# Altium schematic sheet touch.SchDoc
size A4; SheetNumber: 2; SheetTotal: 3
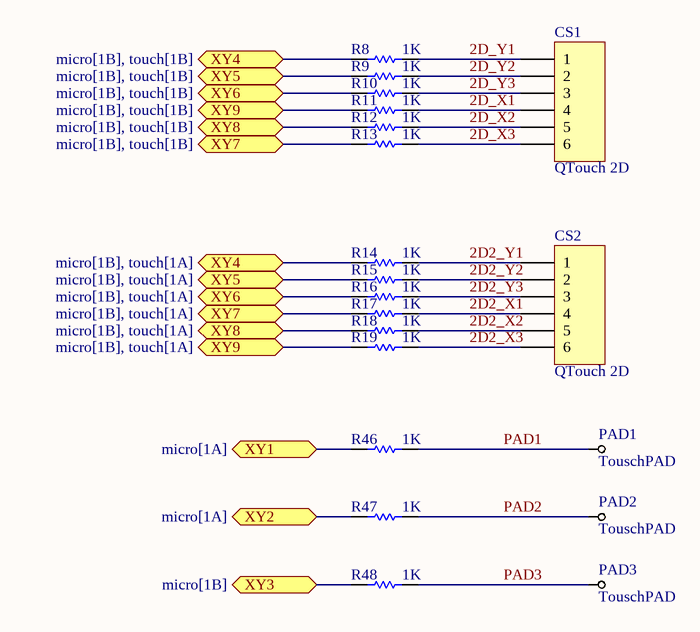
[diagram p0: touch.SchDoc]

## Parts
CS1  QTouch 2D  [wheel]
CS2  QTouch 2D  [2D_touch _wheel]
PAD1  TouschPAD  [touchpad7]  (no BOM)
PAD2  TouschPAD  [touchpad7]  (no BOM)
PAD3  TouschPAD  [touchpad7]  (no BOM)
R8  1K  [RES 0805 (2012X06L)]
R9  1K  [RES 0805 (2012X06L)]
R10  1K  [RES 0805 (2012X06L)]
R11  1K  [RES 0805 (2012X06L)]
R12  1K  [RES 0805 (2012X06L)]
R13  1K  [RES 0805 (2012X06L)]
R14  1K  [RES 0805 (2012X06L)]
R15  1K  [RES 0805 (2012X06L)]
R16  1K  [RES 0805 (2012X06L)]
R17  1K  [RES 0805 (2012X06L)]
R18  1K  [RES 0805 (2012X06L)]
R19  1K  [RES 0805 (2012X06L)]
R46  1K  [RES 0805 (2012X06L)]
R47  1K  [RES 0805 (2012X06L)]
R48  1K  [RES 0805 (2012X06L)]

## Ports
XY1 (bidir, see micro[1A]), XY2 (bidir, see micro[1A]), XY3 (bidir, see micro[1B]), XY4 (bidir, see micro[1B], touch[1A]), XY4 (bidir, see micro[1B], touch[1B]), XY5 (bidir, see micro[1B], touch[1A]), XY5 (bidir, see micro[1B], touch[1B]), XY6 (bidir, see micro[1B], touch[1A]), XY6 (bidir, see micro[1B], touch[1B]), XY7 (bidir, see micro[1B], touch[1A]), XY7 (bidir, see micro[1B], touch[1B]), XY8 (bidir, see micro[1B], touch[1A]), XY8 (bidir, see micro[1B], touch[1B]), XY9 (bidir, see micro[1B], touch[1A]), XY9 (bidir, see micro[1B], touch[1B])

## Nets
2D2_X1: CS2.4 R17.1
2D2_X2: CS2.5 R18.1
2D2_X3: CS2.6 R19.1
2D2_Y1: CS2.1 R14.1
2D2_Y2: CS2.2 R15.1
2D2_Y3: CS2.3 R16.1
2D_X1: CS1.4 R11.1
2D_X2: CS1.5 R12.1
2D_X3: CS1.6 R13.1
2D_Y1: CS1.1 R8.1
2D_Y2: CS1.2 R9.1
2D_Y3: CS1.3 R10.1
PAD1: PAD1.1(T) R46.1
PAD2: PAD2.1(T) R47.1
PAD3: PAD3.1(T) R48.1
XY1: R46.2 ; port XY1
XY2: R47.2 ; port XY2
XY3: R48.2 ; port XY3
XY4: R8.2 R14.2 ; port XY4
XY5: R9.2 R15.2 ; port XY5
XY6: R10.2 R16.2 ; port XY6
XY7: R13.2 R17.2 ; port XY7
XY8: R12.2 R18.2 ; port XY8
XY9: R11.2 R19.2 ; port XY9

## Library data of the parts
CS1 CS2 = Header 6: 3 by 3 2D touch surface; LatestRevisionDate: 17-Jul-2002; LatestRevisionNote: Re-released for DXP Platform.; Publisher: Altium Limited
PAD1-PAD3 = Test Point
R8-R19 R46-R48 = Res1: Resistor; Published: 8-Jun-2000; LatestRevisionDate: 17-Jul-2002; LatestRevisionNote: Re-released for DXP Platform.; PackageReference: AXIAL-0.3; Publisher: Altium Limited; PackageDescription: Axial Device, Thru-Hole; 2 Leads; 0.3 in Pin Spacing; Value: 1K